# EAGLE schematic raspi_reprap (EAGLE 6.5.0)
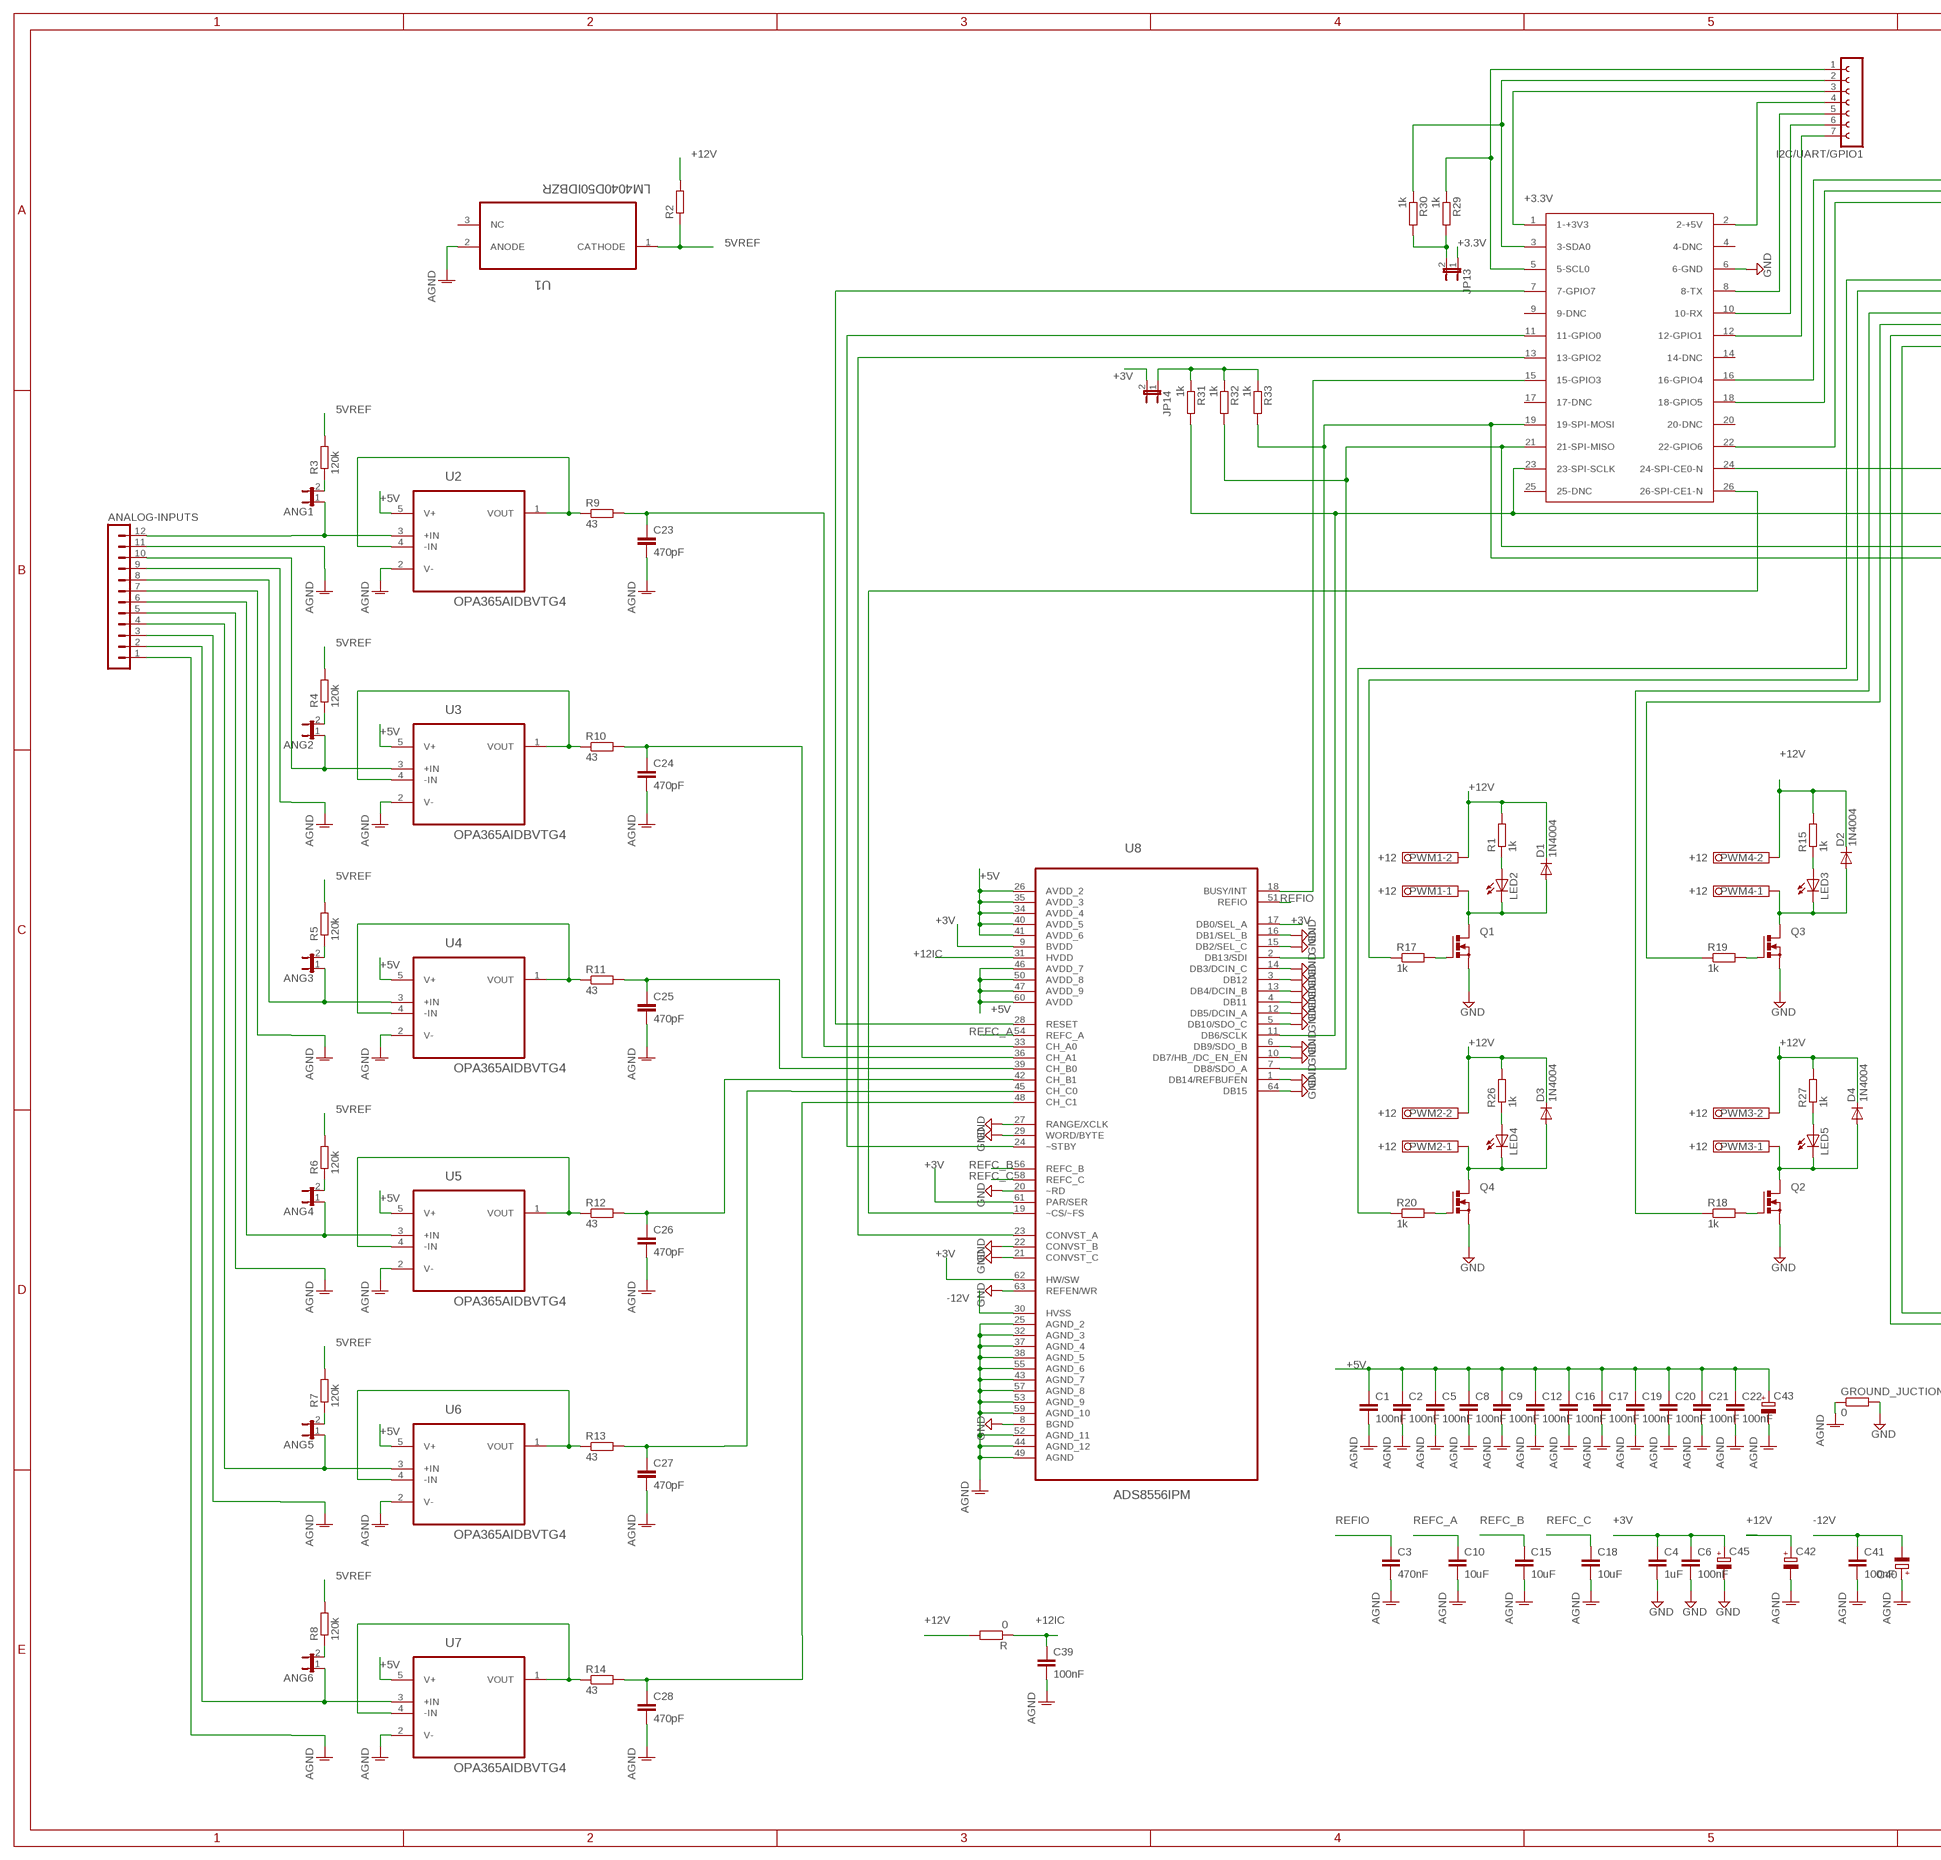
[diagram p0: schematic, sheet 1, part 1 of 2]
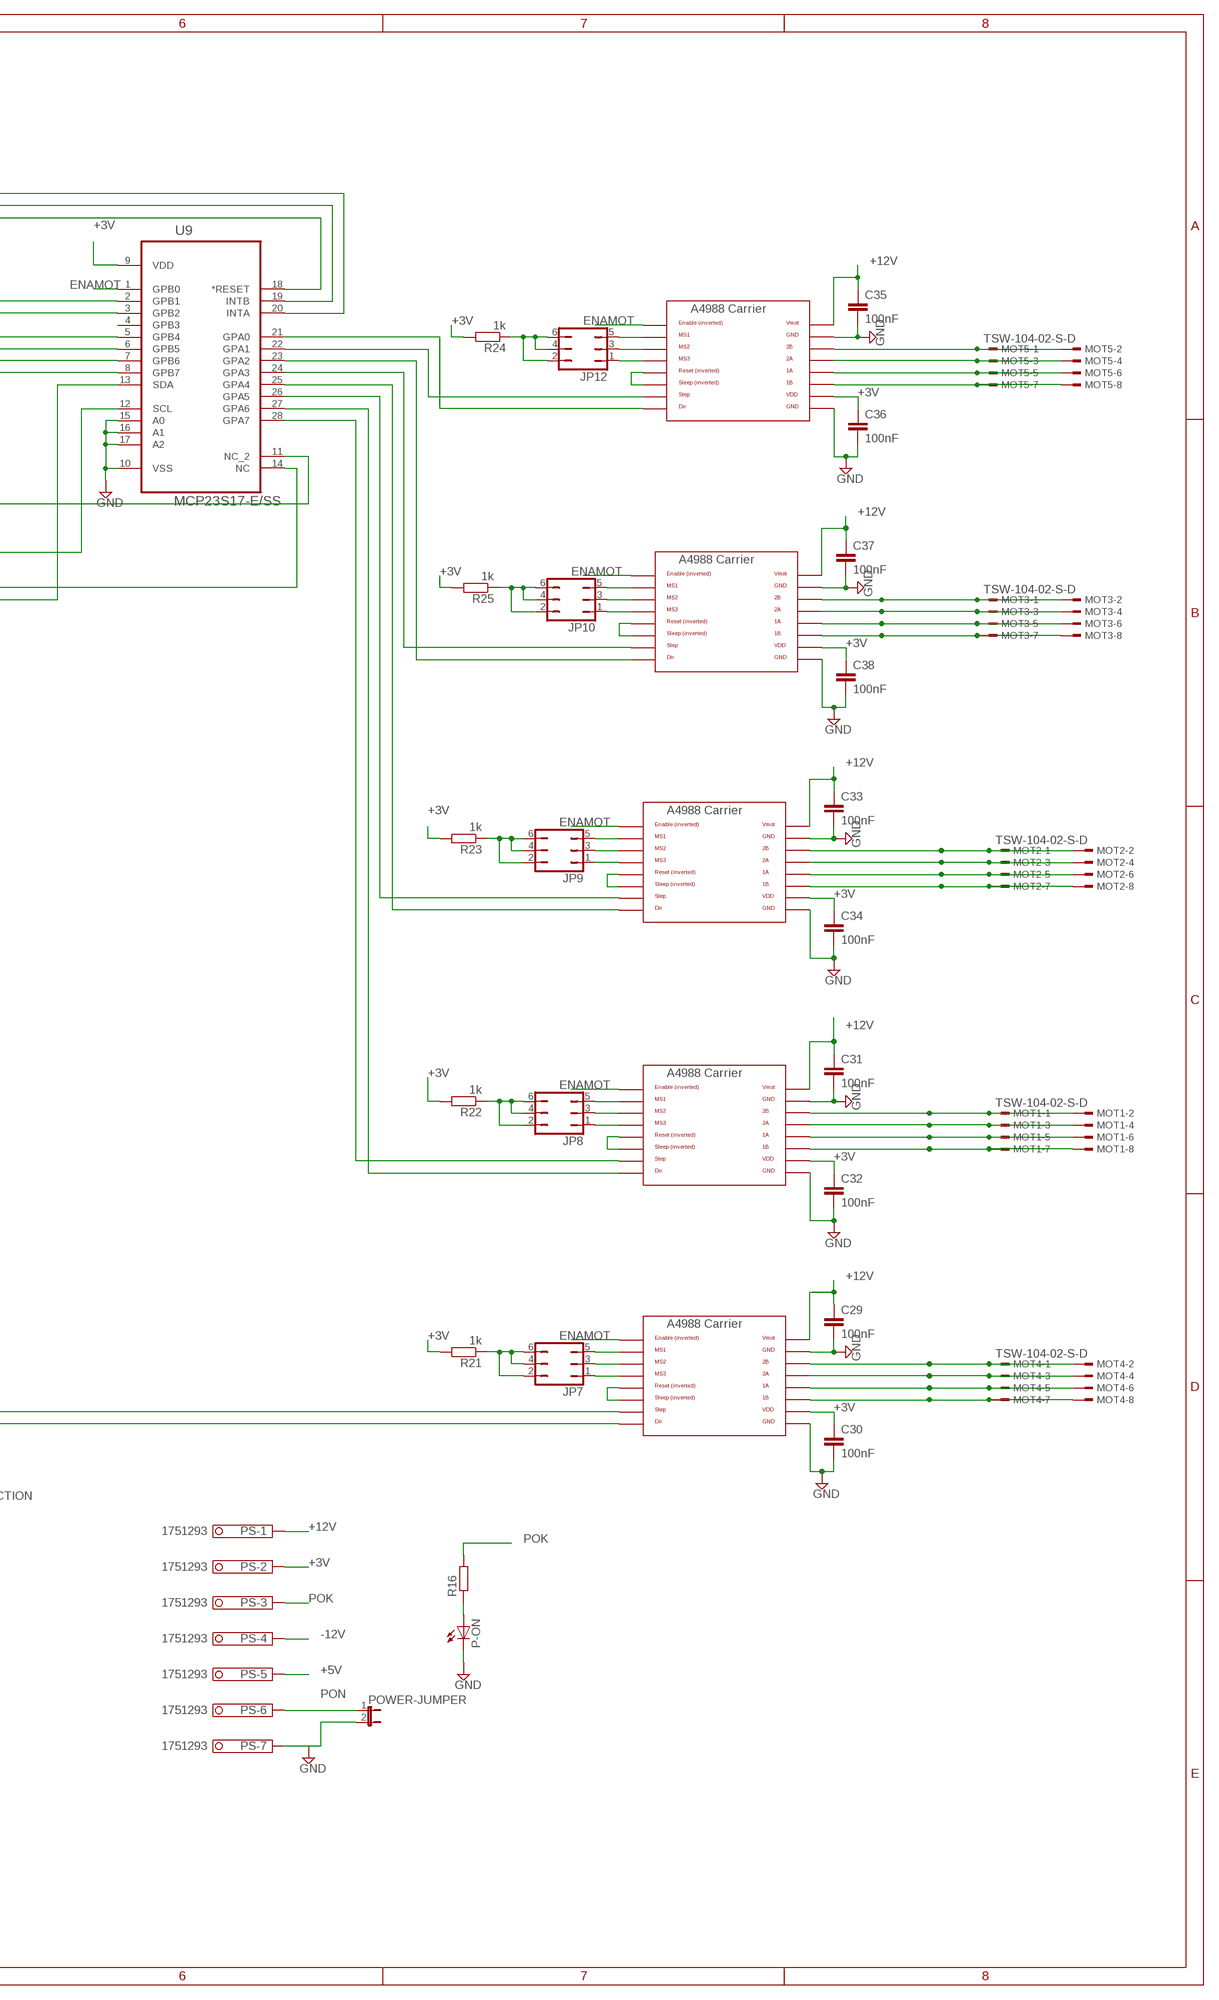
[diagram p1: schematic, sheet 1, part 2 of 2]

## Parts
ANALOG-INPUTS  MA12-1  [MA12-1]
ANG1  JP1E  [JP1]
ANG2  JP1E  [JP1]
ANG3  JP1E  [JP1]
ANG4  JP1E  [JP1]
ANG5  JP1E  [JP1]
ANG6  JP1E  [JP1]
C1  100nF  C-EUC0805  [C0805]
C2  100nF  C-EUC0805  [C0805]
C3  470nF  C-EUC0805  [C0805]
C4  1uF  C-EUC0805  [C0805]
C5  100nF  C-EUC0805  [C0805]
C6  100nF  C-EUC0805  [C0805]
C8  100nF  C-EUC0805  [C0805]
C9  100nF  C-EUC0805  [C0805]
C10  10uF  C-EUC0805  [C0805]
C12  100nF  C-EUC0805  [C0805]
C15  10uF  C-EUC0805  [C0805]
C16  100nF  C-EUC0805  [C0805]
C17  100nF  C-EUC0805  [C0805]
C18  10uF  C-EUC0805  [C0805]
C19  100nF  C-EUC0805  [C0805]
C20  100nF  C-EUC0805  [C0805]
C21  100nF  C-EUC0805  [C0805]
C22  100nF  C-EUC0805  [C0805]
C23  470pF  C-EUC0805  [C0805]
C24  470pF  C-EUC0805  [C0805]
C25  470pF  C-EUC0805  [C0805]
C26  470pF  C-EUC0805  [C0805]
C27  470pF  C-EUC0805  [C0805]
C28  470pF  C-EUC0805  [C0805]
C29  100nF  C-EUC0805  [C0805]
C30  100nF  C-EUC0805  [C0805]
C31  100nF  C-EUC0805  [C0805]
C32  100nF  C-EUC0805  [C0805]
C33  100nF  C-EUC0805  [C0805]
C34  100nF  C-EUC0805  [C0805]
C35  100nF  C-EUC0805  [C0805]
C36  100nF  C-EUC0805  [C0805]
C37  100nF  C-EUC0805  [C0805]
C38  100nF  C-EUC0805  [C0805]
C39  100nF  C-EUC0805  [C0805]
C40  CPOL-EUE2.5-7  [E2,5-7]
C41  100nF  C-EUC0805  [C0805]
C42  CPOL-EUE2.5-7  [E2,5-7]
C43  CPOL-EUE2.5-7  [E2,5-7]
C45  CPOL-EUE2.5-7  [E2,5-7]
D1  1N4004  [DO41-10]
D2  1N4004  [DO41-10]
D3  1N4004  [DO41-10]
D4  1N4004  [DO41-10]
GROUND_JUCTION  0  R-EU_R0805  [R0805]
I2C/UART/GPIO1  FE07-1  [FE07]
JP7  JP3Q  [JP3Q]
JP8  JP3Q  [JP3Q]
JP9  JP3Q  [JP3Q]
JP10  JP3Q  [JP3Q]
JP12  JP3Q  [JP3Q]
JP13  JP1E  [JP1]
JP14  JP1E  [JP1]
LED2  LEDCHIP-LED0805  [CHIP-LED0805]
LED3  LEDCHIP-LED0805  [CHIP-LED0805]
LED4  LEDCHIP-LED0805  [CHIP-LED0805]
LED5  LEDCHIP-LED0805  [CHIP-LED0805]
MOT1  TSW-104-02-S-D  [TSW-104-02-S-D]
MOT2  TSW-104-02-S-D  [TSW-104-02-S-D]
MOT3  TSW-104-02-S-D  [TSW-104-02-S-D]
MOT4  TSW-104-02-S-D  [TSW-104-02-S-D]
MOT5  TSW-104-02-S-D  [TSW-104-02-S-D]
P-ON  LEDCHIP-LED0805  [CHIP-LED0805]
POWER-JUMPER  JP1E  [JP1]
PS  1751293  [1751293]
PWM1  +12  1751248  [1751248]
PWM2  +12  1751248  [1751248]
PWM3  +12  1751248  [1751248]
PWM4  +12  1751248  [1751248]
Q1  PMOSFET_NTO220BV  [TO220BV]
Q2  PMOSFET_NTO220BV  [TO220BV]
Q3  PMOSFET_NTO220BV  [TO220BV]
Q4  PMOSFET_NTO220BV  [TO220BV]
R  0  R-EU_R0805  [R0805]
R1  1k  R-EU_R0805  [R0805]
R2  R-EU_R0805  [R0805]
R3  120k  R-EU_R0805  [R0805]
R4  120k  R-EU_R0805  [R0805]
R5  120k  R-EU_R0805  [R0805]
R6  120k  R-EU_R0805  [R0805]
R7  120k  R-EU_R0805  [R0805]
R8  120k  R-EU_R0805  [R0805]
R9  43  R-EU_R0805  [R0805]
R10  43  R-EU_R0805  [R0805]
R11  43  R-EU_R0805  [R0805]
R12  43  R-EU_R0805  [R0805]
R13  43  R-EU_R0805  [R0805]
R14  43  R-EU_R0805  [R0805]
R15  1k  R-EU_R0805  [R0805]
R16  R-EU_R0805  [R0805]
R17  1k  R-EU_R0805  [R0805]
R18  1k  R-EU_R0805  [R0805]
R19  1k  R-EU_R0805  [R0805]
R20  1k  R-EU_R0805  [R0805]
R21  1k  R-EU_R0805  [R0805]
R22  1k  R-EU_R0805  [R0805]
R23  1k  R-EU_R0805  [R0805]
R24  1k  R-EU_R0805  [R0805]
R25  1k  R-EU_R0805  [R0805]
R26  1k  R-EU_R0805  [R0805]
R27  1k  R-EU_R0805  [R0805]
R29  1k  R-EU_R0805  [R0805]
R30  1k  R-EU_R0805  [R0805]
R31  1k  R-EU_R0805  [R0805]
R32  1k  R-EU_R0805  [R0805]
R33  1k  R-EU_R0805  [R0805]
RPI-HEADER  RASPBERRY-PI  [RASPBERRY-PI]
U1  LM4040D50IDBZR  [SOT95P237X112-3N]
U2  OPA365AIDBVTG4  [SOT95P280X145-5N]
U3  OPA365AIDBVTG4  [SOT95P280X145-5N]
U4  OPA365AIDBVTG4  [SOT95P280X145-5N]
U5  OPA365AIDBVTG4  [SOT95P280X145-5N]
U6  OPA365AIDBVTG4  [SOT95P280X145-5N]
U7  OPA365AIDBVTG4  [SOT95P280X145-5N]
U8  ADS8556IPM  [QFP50P1200X1200X160-64N]
U9  MCP23S17-E/SS  [SOP65P780X200-28N]
U$2  A4983CARRIER  [A4988BREAKOUT]
U$3  A4983CARRIER  [A4988BREAKOUT]
U$4  A4983CARRIER  [A4988BREAKOUT]
U$5  A4983CARRIER  [A4988BREAKOUT]
U$6  A4983CARRIER  [A4988BREAKOUT]

## Nets
5VREF: R2.1 R3.2 R4.2 R5.2 R6.2 R7.2 R8.2 U1.1(CATHODE)
+3.3V: I2C/UART/GPIO1.3 JP13.1 RPI-HEADER.1(1-+3V3)
+3V: C4.1 C6.1 C30.1 C32.1 C34.1 C36.1 C38.1 C45.+ JP14.2 PS.2 R21.2 R22.2 R23.2 R24.2 R25.2 U8.9(BVDD) U8.17(DB0/SEL_A) U8.61(PAR/SER) U8.62(HW/SW) U9.9(VDD) U$2.VDD U$3.VDD U$4.VDD U$5.VDD U$6.VDD
+5V: C1.1 C2.1 C5.1 C8.1 C9.1 C12.1 C16.1 C17.1 C19.1 C20.1 C21.1 C22.1 C43.+ PS.5 U2.5(V+) U3.5(V+) U4.5(V+) U5.5(V+) U6.5(V+) U7.5(V+) U8.26(AVDD_2) U8.34(AVDD_4) U8.35(AVDD_3) U8.40(AVDD_5) U8.41(AVDD_6) U8.46(AVDD_7) U8.47(AVDD_9) U8.50(AVDD_8) U8.60(AVDD)
+12IC: C39.1 R.1 U8.31(HVDD)
+12V: C29.1 C31.1 C33.1 C35.1 C37.1 C42.+ D1.C D2.C D3.C D4.C PS.1 PWM1.2 PWM2.2 PWM3.2 PWM4.2 R1.2 R2.2 R15.2 R26.2 R27.2 R.2 U$2.VMOT U$3.VMOT U$4.VMOT U$5.VMOT U$6.VMOT
-12V: C40.- C41.1 PS.4 U8.30(HVSS)
AGND: ANALOG-INPUTS.1 ANALOG-INPUTS.3 ANALOG-INPUTS.5 ANALOG-INPUTS.7 ANALOG-INPUTS.9 ANALOG-INPUTS.11 C1.2 C2.2 C3.2 C5.2 C8.2 C9.2 C10.2 C12.2 C15.2 C16.2 C17.2 C18.2 C19.2 C20.2 C21.2 C22.2 C23.2 C24.2 C25.2 C26.2 C27.2 C28.2 C39.2 C40.+ C41.2 C42.- C43.- GROUND_JUCTION.1 U1.2(ANODE) U2.2(V-) U3.2(V-) U4.2(V-) U5.2(V-) U6.2(V-) U7.2(V-) U8.25(AGND_2) U8.32(AGND_3) U8.37(AGND_4) U8.38(AGND_5) U8.43(AGND_7) U8.44(AGND_12) U8.49(AGND) U8.52(AGND_11) U8.53(AGND_9) U8.55(AGND_6) U8.57(AGND_8) U8.59(AGND_10)
CE1: RPI-HEADER.24(24-SPI-CE0-N) U9.11(NC_2)
CE2: RPI-HEADER.26(26-SPI-CE1-N) U8.19(~CS/~FS)
CLK: R31.2 RPI-HEADER.23(23-SPI-SCLK) U8.11(DB6/SCLK) U9.12(SCL)
ENAMOT: U9.1(GPB0) U$2.EN U$3.EN U$4.EN U$5.EN U$6.EN
GND: C4.2 C6.2 C29.2 C30.2 C31.2 C32.2 C33.2 C34.2 C35.2 C36.2 C37.2 C38.2 C45.- GROUND_JUCTION.2 P-ON.C POWER-JUMPER.2 PS.7 Q1.S Q2.S Q3.S Q4.S RPI-HEADER.6(6-GND) U8.1(DB14/REFBUFEN) U8.3(DB12) U8.4(DB11) U8.5(DB10/SDO_C) U8.6(DB9/SDO_B) U8.8(BGND) U8.10(DB7/HB_/DC_EN_EN) U8.12(DB5/DCIN_A) U8.13(DB4/DCIN_B) U8.14(DB3/DCIN_C) U8.15(DB2/SEL_C) U8.16(DB1/SEL_B) U8.20(~RD) U8.21(CONVST_C) U8.22(CONVST_B) U8.27(RANGE/XCLK) U8.29(WORD/BYTE) U8.63(REFEN/WR) U8.64(DB15) U9.10(VSS) U9.15(A0) U9.16(A1) U9.17(A2) U$2.GND U$2.GND@0(GND) U$3.GND U$3.GND@0(GND) U$4.GND U$4.GND@0(GND) U$5.GND U$5.GND@0(GND) U$6.GND U$6.GND@0(GND)
GPIO1: I2C/UART/GPIO1.7 RPI-HEADER.12(12-GPIO1)
M1-MOT2: MOT4.3 MOT4.4 U$2.2A
M1-MOT3: MOT4.5 MOT4.6 U$2.1A
M1-MOT4: MOT4.7 MOT4.8 U$2.1B
M2-MOT1: MOT1.1 MOT1.2 U$3.2B
M2-MOT2: MOT1.3 MOT1.4 U$3.2A
M2-MOT3: MOT1.5 MOT1.6 U$3.1A
M2-MOT4: MOT1.7 MOT1.8 U$3.1B
M3-MOT1: MOT2.1 MOT2.2 U$4.2B
M3-MOT2: MOT2.3 MOT2.4 U$4.2A
M3-MOT3: MOT2.5 MOT2.6 U$4.1A
M3-MOT4: MOT2.7 MOT2.8 U$4.1B
M4-MOT1: MOT5.1 MOT5.2 U$5.2B
M4-MOT2: MOT5.3 MOT5.4 U$5.2A
M4-MOT3: MOT5.5 MOT5.6 U$5.1A
M4-MOT4: MOT5.7 MOT5.8 U$5.1B
M5-MOT1: MOT3.1 MOT3.2 U$6.2B
M5-MOT2: MOT3.3 MOT3.4 U$6.2A
M5-MOT3: MOT3.5 MOT3.6 U$6.1A
M5-MOT4: MOT3.7 MOT3.8 U$6.1B
MISO: R32.2 RPI-HEADER.21(21-SPI-MISO) U8.7(DB8/SDO_A) U9.14(NC)
MOSI: R33.2 RPI-HEADER.19(19-SPI-MOSI) U8.2(DB13/SDI) U9.13(SDA)
MOT4: MOT4.1 MOT4.2 U$2.2B
N$1: C25.1 R11.2 U8.39(CH_B0)
N$2: ANALOG-INPUTS.8 ANG3.1 U4.3(+IN)
N$3: R11.1 U4.1(VOUT) U4.4(-IN)
N$4: ANG3.2 R5.1
N$5: Q2.G R18.2
N$6: C26.1 R12.2 U8.42(CH_B1)
N$7: RPI-HEADER.15(15-GPIO3) U8.18(BUSY/INT)
N$8: JP7.3 U$2.MS2
N$9: U9.21(GPA0) U$5.DIR
N$10: P-ON.A R16.1
N$11: JP7.1 U$2.MS3
N$12: Q1.G R17.2
N$13: ANALOG-INPUTS.6 ANG4.1 U5.3(+IN)
N$14: ANALOG-INPUTS.12 ANG1.1 U2.3(+IN)
N$15: R9.1 U2.1(VOUT) U2.4(-IN)
N$16: C23.1 R9.2 U8.33(CH_A0)
N$17: R12.1 U5.1(VOUT) U5.4(-IN)
N$18: ANG1.2 R3.1
N$19: ANG4.2 R6.1
N$20: RPI-HEADER.22(22-GPIO6) U9.18(*RESET)
N$21: RPI-HEADER.13(13-GPIO2) U8.23(CONVST_A)
N$22: RPI-HEADER.18(18-GPIO5) U9.19(INTB)
N$23: C28.1 R14.2 U8.48(CH_C1)
N$24: C24.1 R10.2 U8.36(CH_A1)
N$25: JP12.5 U$5.MS1
N$26: Q3.G R19.2
N$27: JP10.5 U$6.MS1
N$28: JP9.5 U$4.MS1
N$29: JP8.2 JP8.4 JP8.6 R22.1
N$30: JP7.2 JP7.4 JP7.6 R21.1
N$31: JP12.3 U$5.MS2
N$32: JP12.1 U$5.MS3
N$33: U9.22(GPA1) U$5.STEP
N$34: R20.1 U9.2(GPB1)
N$35: U$2.RST U$2.SLP(SLEEP)
N$36: RPI-HEADER.16(16-GPIO4) U9.20(INTA)
N$37: R17.1 U9.3(GPB2)
N$38: R18.1 U9.5(GPB4)
N$39: JP8.5 U$3.MS1
N$40: RPI-HEADER.7(7-GPIO7) U8.28(RESET)
N$41: JP8.3 U$3.MS2
N$42: JP8.1 U$3.MS3
N$43: JP9.3 U$4.MS2
N$44: U9.23(GPA2) U$6.DIR
N$45: U9.24(GPA3) U$6.STEP
N$46: U$3.RST U$3.SLP(SLEEP)
N$47: Q4.G R20.2
N$48: JP9.1 U$4.MS3
N$49: JP10.3 U$6.MS2
N$50: JP10.1 U$6.MS3
N$51: JP7.5 U$2.MS1
N$52: LED2.A R1.1
N$53: LED5.A R27.1
N$54: JP9.2 JP9.4 JP9.6 R23.1
N$55: JP13.2 R29.2 R30.2
N$56: LED3.A R15.1
N$57: U9.25(GPA4) U$4.DIR
N$58: U9.26(GPA5) U$4.STEP
N$59: U$4.RST U$4.SLP(SLEEP)
N$60: I2C/UART/GPIO1.6 RPI-HEADER.10(10-RX)
N$61: LED4.A R26.1
N$62: I2C/UART/GPIO1.5 RPI-HEADER.8(8-TX)
N$63: I2C/UART/GPIO1.4 RPI-HEADER.2(2-+5V)
N$64: R30.1 RPI-HEADER.3(3-SDA0)
N$65: I2C/UART/GPIO1.1 R29.1 RPI-HEADER.5(5-SCL0)
N$67: JP12.2 JP12.4 JP12.6 R24.1
N$70: U9.27(GPA6) U$3.DIR
N$71: U9.28(GPA7) U$3.STEP
N$72: U$5.RST U$5.SLP(SLEEP)
N$73: ANALOG-INPUTS.10 ANG2.1 U3.3(+IN)
N$77: JP14.1 R31.1 R32.1 R33.1
N$80: R10.1 U3.1(VOUT) U3.4(-IN)
N$82: ANG2.2 R4.1
N$84: R19.1 U9.6(GPB5)
N$85: C27.1 R13.2 U8.45(CH_C0)
N$86: ANALOG-INPUTS.4 ANG5.1 U6.3(+IN)
N$87: U9.7(GPB6) U$2.DIR
N$88: U9.8(GPB7) U$2.STEP
N$89: JP10.2 JP10.4 JP10.6 R25.1
N$94: U$6.RST U$6.SLP(SLEEP)
N$95: R13.1 U6.1(VOUT) U6.4(-IN)
N$96: ANG5.2 R7.1
N$104: ANALOG-INPUTS.2 ANG6.1 U7.3(+IN)
N$106: R14.1 U7.1(VOUT) U7.4(-IN)
N$107: ANG6.2 R8.1
N$109: RPI-HEADER.11(11-GPIO0) U8.24(~STBY)
POK: PS.3 R16.2
PON: POWER-JUMPER.1 PS.6
PWM1: D4.A LED5.C PWM3.1 Q2.D
PWM2: D1.A LED2.C PWM1.1 Q1.D
PWM3: D2.A LED3.C PWM4.1 Q3.D
PWM4: D3.A LED4.C PWM2.1 Q4.D
REFC_A: C10.1 U8.54(REFC_A)
REFC_B: C15.1 U8.56(REFC_B)
REFC_C: C18.1 U8.58(REFC_C)
REFIO: C3.1 U8.51(REFIO)
Unconnected: I2C/UART/GPIO1.2 RPI-HEADER.4(4-DNC) RPI-HEADER.9(9-DNC) RPI-HEADER.14(14-DNC) RPI-HEADER.17(17-DNC) RPI-HEADER.20(20-DNC) RPI-HEADER.25(25-DNC) U1.3(NC) U9.4(GPB3)

## Library data of the parts
ANALOG-INPUTS = con-lstb:MA12-1: PIN HEADER; OC_FARNELL: unknown; OC_NEWARK: unknown
ANG1-ANG6 JP13 JP14 POWER-JUMPER = jumper:JP1E: JUMPER
C1-C6 C8-C10 C12 C15-C39 C41 = rcl:C-EU: CAPACITOR, European symbol
C40 C42 C43 C45 = rcl:CPOL-EU: POLARIZED CAPACITOR, European symbol
D1-D4 = diode:1N4004: DIODE general purpose rectifier, 1 A
GROUND_JUCTION = resistor:R-EU_: RESISTOR, European symbol
I2C/UART/GPIO1 = con-lsta:FE07-1: FEMALE HEADER; OC_FARNELL: unknown; OC_NEWARK: unknown
JP7-JP10 JP12 = jumper:JP3Q: JUMPER
LED2-LED5 P-ON = led:LED: LED OSRAM: - CHIPLED LG R971, LG N971, LY N971, LG Q971, LY Q971, LO R971, LY R971 LH N974, LH R974 LS Q976, LO Q976, LY Q976 LO Q996 - Hyper CHIPLED LW Q18S LB Q993, LB Q99A, LB R99A - SideLED LS A670, LO A670, LY A670, LG A670, LP A670 LB A673, LV A673, LT A673, LW A673 LH A674 LY A675 LS A676, LA A676, LO A676, LY A676, LW A676 LS A679, LY A679, LG A679 - Hyper Micro SIDELED® LS Y876, LA Y876, LO Y876, LY Y876 LT Y87S - SmartLED LW L88C, LW L88S LB L89C, LB L89S, LG L890 LS L89K, LO L89K, LY L89K LS L896, LA L896, LO L896, LY L896 - TOPLED LS T670, LO T670, LY T670, LG T670, LP T670 LSG T670, LSP T670, LSY T670, LOP T670, LYG T670 LG T671, LOG T671, LSG T671 LB T673, LV T673, LT T673, LW T673 LH T674 LS T676, LA T676, LO T676, LY T676, LB T676, LH T676, LSB T676, LW T676 LB T67C, LV T67C, LT T67C, LS T67K, LO T67K, LY T67K, LW E67C LS E67B, LA E67B, LO E67B, LY E67B, LB E67C, LV E67C, LT E67C LW T67C LS T679, LY T679, LG T679 LS T770, LO T770, LY T770, LG T770, LP T770 LB T773, LV T773, LT T773, LW T773 LH T774 LS E675, LA E675, LY E675, LS T675 LS T776, LA T776, LO T776, LY T776, LB T776 LHGB T686 LT T68C, LB T68C - Hyper Mini TOPLED® LB M676 - Mini TOPLED Santana® LG M470 LS M47K, LO M47K, LY M47K Source: http://www.osram.convergy.de LUXEON: - LUMILED® LXK2-PW12-R00, LXK2-PW12-S00, LXK2-PW14-U00, LXK2-PW14-V00 LXK2-PM12-R00, LXK2-PM12-S00, LXK2-PM14-U00 LXK2-PE12-Q00, LXK2-PE12-R00, LXK2-PE12-S00, LXK2-PE14-T00, LXK2-PE14-U00 LXK2-PB12-K00, LXK2-PB12-L00, LXK2-PB12-M00, LXK2-PB14-N00, LXK2-PB14-P00, LXK2-PB14-Q00 LXK2-PR12-L00, LXK2-PR12-M00, LXK2-PR14-Q00, LXK2-PR14-R00 LXK2-PD12-Q00, LXK2-PD12-R00, LXK2-PD12-S00 LXK2-PH12-R00, LXK2-PH12-S00 LXK2-PL12-P00, LXK2-PL12-Q00, LXK2-PL12-R00 Source: www.luxeon.com KINGBRIGHT: KA-3528ASYC Source: www.kingbright.com
MOT1-MOT5 = con-samtec:TSW-104-02-S-D: THROUGH-HOLE .025" SQ POST HEADER Source: Samtec TSW.pdf; OC_FARNELL: unknown; OC_NEWARK: unknown
PS = con-phoenix-350:1751293: MKDS 1/ 7-3,5 Printklemme Nennstrom: 10 A Bemessungsspannung: 160 V Raster: 3,5 mm Polzahl: 7 Montageart: Löten Anschlussart: Schraubanschluss Anschlussrichtung vom Leiter zur Platine: 0° Source: http://eshop.phoenixcontact.com .. 1751293.pdf; OC_FARNELL: unknown; OC_NEWARK: unknown
PWM1-PWM4 = con-phoenix-350:1751248: MKDS 1/ 2-3,5 Printklemme Nennstrom: 10 A Bemessungsspannung: 160 V Raster: 3,5 mm Polzahl: 2 Montageart: Löten Anschlussart: Schraubanschluss Anschlussrichtung vom Leiter zur Platine: 0° Source: http://eshop.phoenixcontact.com .. 1751248.pdf; OC_FARNELL: unknown; OC_NEWARK: unknown
Q1-Q4 = transistor-power:PMOSFET_N: Power MOSFET N-Channel
R R1-R27 R29-R33 = rcl:R-EU_: RESISTOR, European symbol
RPI-HEADER = RaspberryPi:RASPBERRY-PI: Raspberry Pi Board <http://www.raspberrypi.org/> Jacques Lagnel V1.0 (beta) 2012 Board dimension: Forum 3D model <http://www.raspberrypi.org/forum/general-discussion/mechanical-profile-3d-models?value=3d%20model&type=1&include=1&search=1&ret=all> The GPIO Connector (P1): http://elinux.org/RPi_Low-level_peripherals
U1 = shuntreference:LM4040D50IDBZR: PRECISION MICROPOWER SHUNT VOLTAGE REFERENCE; MPN: LM4040D50IDBZR; OC_FARNELL: 1652239; OC_NEWARK: 43K3367; PACKAGE: 3-SOT-23; SUPPLIER: TEXAS INSTRUMENTS
U2-U7 = amp2:OPA365AIDBVTG4: OPERATIONAL AMPLIFIER; MPN: OPA365AIDBVTG4; OC_FARNELL: 1276091; OC_NEWARK: -; PACKAGE: SOT-23-5; SUPPLIER: TEXAS INSTRUMENTS
U8 = ADC:ADS8556IPM: ANALOG-TO-DIGITAL CONVERTERS; MPN: ADS8556IPM; OC_FARNELL: 1762983; OC_NEWARK: 26R5213; PACKAGE: QFP-64; SUPPLIER: TEXAS INSTRUMENTS
U9 = mcspi:MCP23S17-E/SS: IC, 16-Bit I/O Expander with Serial Interface, SSOP-28; MPN: MCP23S17-E/SS; OC_FARNELL: 1467675; OC_NEWARK: 31K2952; PACKAGE: SSOP-28; SUPPLIER: Microchip
U$2-U$6 = RepRapjr:A4983CARRIER